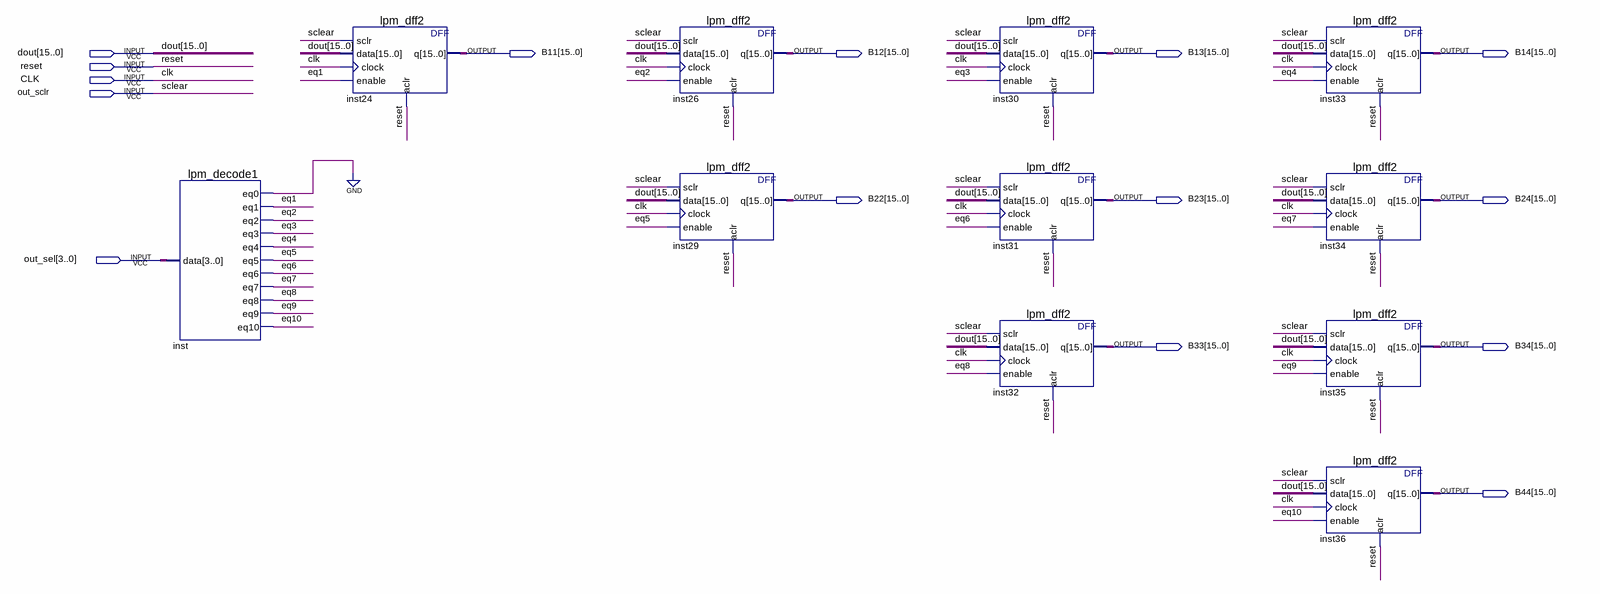
[diagram p0: schematic sheet]
// Quartus schematic out_reg.bdf as structural Verilog: 11 symbols, 15 pins
module out_reg (
  input  [15:0] dout,
  input  reset,
  input  CLK,
  input  out_sclr,
  input  [3:0] out_sel,
  output [15:0] B11,
  output [15:0] B12,
  output [15:0] B13,
  output [15:0] B14,
  output [15:0] B22,
  output [15:0] B23,
  output [15:0] B24,
  output [15:0] B33,
  output [15:0] B34,
  output [15:0] B44
);

  wire eq1, eq2, eq3, eq4, eq5, eq6, eq7, eq8, eq9, eq10, inst_eq0;

  lpm_decode1 inst (
    .data(out_sel), .eq0(inst_eq0), .eq1(eq1), .eq2(eq2), .eq3(eq3), .eq4(eq4), .eq5(eq5), .eq6(eq6),
    .eq7(eq7), .eq8(eq8), .eq9(eq9), .eq10(eq10));
  lpm_dff2 inst24 (.sclr(out_sclr), .data(dout), .clock(CLK), .enable(eq1), .aclr(reset), .q(B11));
  lpm_dff2 inst26 (.sclr(out_sclr), .data(dout), .clock(CLK), .enable(eq2), .aclr(reset), .q(B12));
  lpm_dff2 inst29 (.sclr(out_sclr), .data(dout), .clock(CLK), .enable(eq5), .aclr(reset), .q(B22));
  lpm_dff2 inst30 (.sclr(out_sclr), .data(dout), .clock(CLK), .enable(eq3), .aclr(reset), .q(B13));
  lpm_dff2 inst31 (.sclr(out_sclr), .data(dout), .clock(CLK), .enable(eq6), .aclr(reset), .q(B23));
  lpm_dff2 inst32 (.sclr(out_sclr), .data(dout), .clock(CLK), .enable(eq8), .aclr(reset), .q(B33));
  lpm_dff2 inst33 (.sclr(out_sclr), .data(dout), .clock(CLK), .enable(eq4), .aclr(reset), .q(B14));
  lpm_dff2 inst34 (.sclr(out_sclr), .data(dout), .clock(CLK), .enable(eq7), .aclr(reset), .q(B24));
  lpm_dff2 inst35 (.sclr(out_sclr), .data(dout), .clock(CLK), .enable(eq9), .aclr(reset), .q(B34));
  lpm_dff2 inst36 (.sclr(out_sclr), .data(dout), .clock(CLK), .enable(eq10), .aclr(reset), .q(B44));
  // also tied to GND on the sheet: inst_eq0

  // Other names for the same wires on the sheet: sclear = out_sclr
endmodule
